# Altium project Digital_Power_Interface_Electronics.PrjPcb
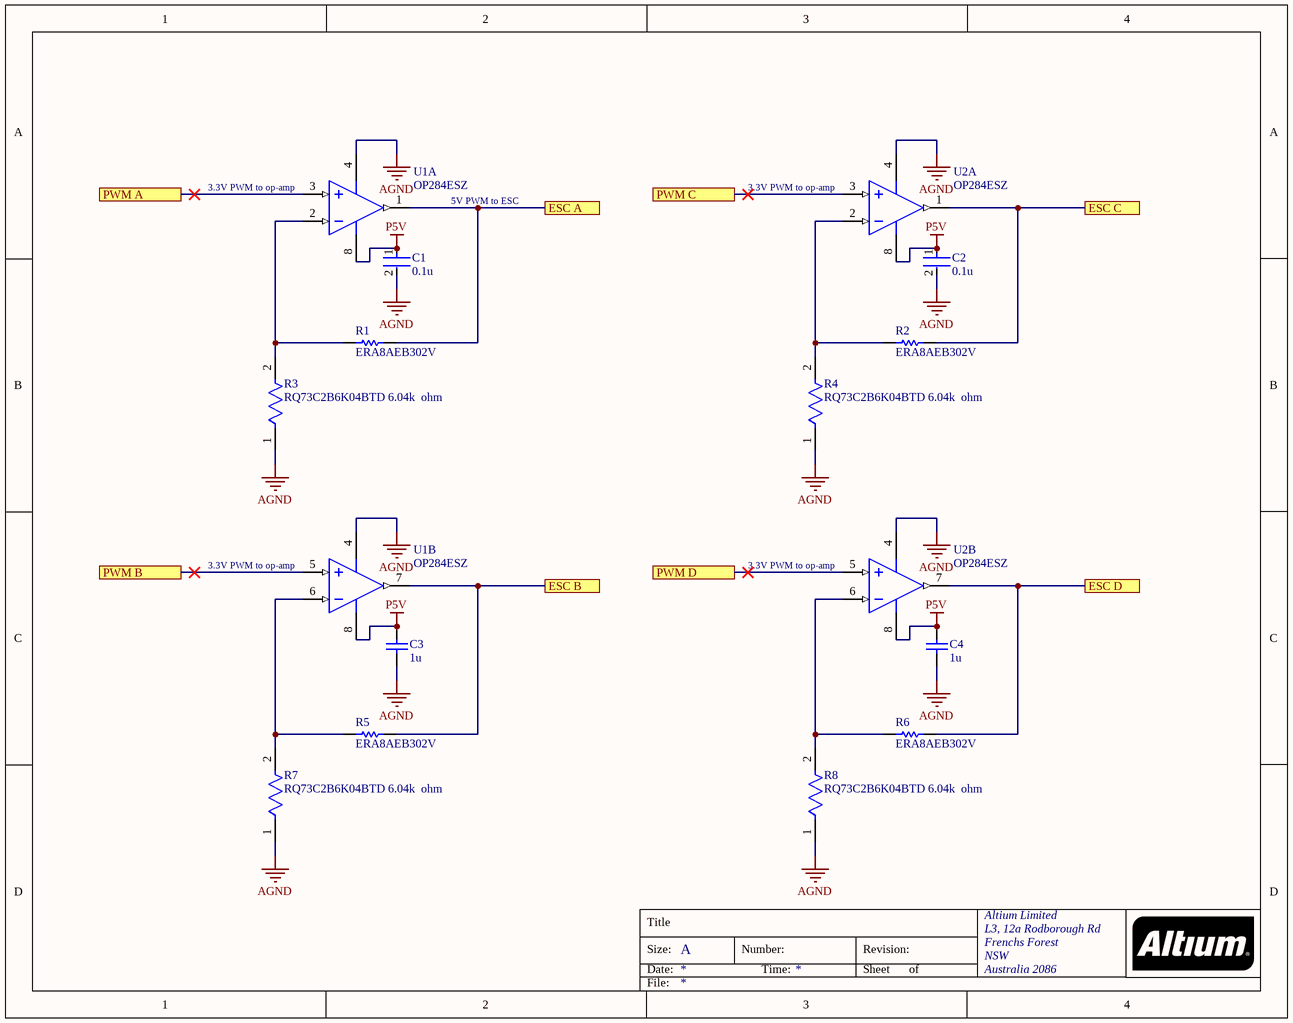
[diagram p0: PWM_Signal_Amplifiers.SchDoc]
3 sheets, 28 parts. Net scope: flat (ports and power ports of the same name join across sheets).
Board file: digital_power_board.PcbDoc
Sheets:
  PWM_Signal_Amplifiers.SchDoc
  MPU6050_Gyro_Accel_Temp.SchDoc
  Voltage_Regulator_5V.SchDoc

## Sheet PWM_Signal_Amplifiers.SchDoc
size A; Organization: Altium Limited; Address1: L3, 12a Rodborough Rd; Address2: Frenchs Forest; Address3: NSW; Address4: Australia 2086

### Parts
C1  0.1u  [FP-C0402-BB-MFG]
C2  0.1u  [FP-C0402-BB-MFG]
C3  1u  [CAPC3216X110X50LL20T25]
C4  1u  [CAPC3216X110X50LL20T25]
R1  ERA8AEB302V  [RESC3216X70X50ML20T25]
R2  ERA8AEB302V  [RESC3216X70X50ML20T25]
R3  RQ73C2B6K04BTD 6.04k  ohm  [FP-RQ732B-IPC_C]
R4  RQ73C2B6K04BTD 6.04k  ohm  [FP-RQ732B-IPC_C]
R5  ERA8AEB302V  [RESC3216X70X50ML20T25]
R6  ERA8AEB302V  [RESC3216X70X50ML20T25]
R7  RQ73C2B6K04BTD 6.04k  ohm  [FP-RQ732B-IPC_C]
R8  RQ73C2B6K04BTD 6.04k  ohm  [FP-RQ732B-IPC_C]
U1  OP284ESZ  [ADI-R-8_L]  (parts A,B of 2)
U2  OP284ESZ  [ADI-R-8_L]  (parts A,B of 2)

### Ports
ESC A, ESC B, ESC C, ESC D, PWM A, PWM B, PWM C, PWM D

### Nets
AGND: C1.2 C2.2 C3.1 C4.1 R3.1 R4.1 R7.1 R8.1 U1.4(-V) U2.4(-V)
P5V: C1.1 C2.1 C3.2 C4.2 U1.8(+V) U2.8(+V)
NetR1_1: R1.1 R3.2 U1.2(-IN_A)
NetR1_2: R1.2 U1.1(OUT_A) ; port ESC A
NetR2_1: R2.1 R4.2 U2.2(-IN_A)
NetR2_2: R2.2 U2.1(OUT_A) ; port ESC C
NetR5_1: R5.1 R7.2 U1.6(-IN_B)
NetR5_2: R5.2 U1.7(OUT_B) ; port ESC B
NetR6_1: R6.1 R8.2 U2.6(-IN_B)
NetR6_2: R6.2 U2.7(OUT_B) ; port ESC D
NetU1_3: U1.3(+IN_A) ; port PWM A
NetU1_5: U1.5(+IN_B) ; port PWM B
NetU2_3: U2.3(+IN_A) ; port PWM C
NetU2_5: U2.5(+IN_B) ; port PWM D

### Notes on the sheet
- (near U1) 3.3V PWM to op-amp
- 5V PWM to ESC
- (near U2) 3.3V PWM to op-amp
- Title
- Size:
- Date:
- A
- Number:
- Time:
- Revision:
- Sheet
- of
- File:

### Library data of the parts
C1 C2 = CMP-2008-02046-2: CAP CER 0.1UF 10V X5R 0402; Manufacturer: Kemet; Manufacturer Part Number: C0402C104K8PACTU; Material: Ceramic; Capacitance: 0.10 μF; Temperature Coefficient: 15%; Tolerance: 0.1; Value: 0.10 μF; Package: C0402-BB; Temperature: -55°C to +125°C; ComponentLink2Description: Datasheet; Temperature Characteristic: X5R; Device Class L1: Passive Components; Height: 0.55mm; Lead Free: Yes; ComponentLink2URL: https://content.kemet.com/datasheets/KEM_C1002_X7R_SMD.pdf; Device Class L2: Capacitors; Temperature Range Low: -55°C; Temperature Range High: +125°C; RoHS: TRUE; Octopart: https://octopart.com/c0402c104k8pactu-kemet-140039; Automotive: No; Mouser Description: Capacitor 100 nF 10 VDC 0402; Category: Cap; Voltage Rating: 10 V; Digikey Description: CAP CER 0.1UF 10V X5R 0402; Ipc Land Pattern Name: CAPC10050X50; Device Class L3: Ceramic Capacitors
C3 C4 = CMP-2000-06011-1: Chip Capacitor, 1 uF, +/- 10%, 50 V, -55 to 125 degC, 1206 (3216 Metric), RoHS, Tape and Reel; Manufacturer: Kemet; Case Height: 1mm; Dielectric: X7R; Voltage Rating: 50V; Capacitance: 1uF; Temperature Coefficient / Code: +/-15%; Case Length: 3.2mm; Case Width: 1.6mm; Type: SMDMLCCX7R6.3-250VDCCommericalGrade; Class: Class1; Capacitance - nF: 1000nF; Datasheet URL: http://www.kemet.com/docfinder?Partnumber=C1206C105K5RACTU; Product Category: MultilayerCeramicCapacitorsMLCC-SMD/SMT; Termination Style: SMD/SMT; Dimensions: 1.6mmWx3.2mmLx1mmH; Voltage Rating DC: 50V; Datasheet Version: 02/2016; Packaging: Reel; Brand: Kemet; RoHS: Details; Minimum Operating Temperature: -55C; Operating Temperature Range: -55Cto+125C; Package Reference: 1206; Manufacturer URL: http://www.kemet.com/; Product: GeneralTypeMLCCs; Tolerance: 10%; Package Description: 2-Pin Surface Mount Device, Body 3.2 x 1.6 mm; Mounting Technology: SurfaceMount; Case Code - mm: 3216; Maximum Operating Temperature: +125C; Series: C1206C; Factory Pack Quantity: 2500; Package / Case: 1206(3216metric); Case Code - in: 1206
R1 R2 R5 R6 = CMP-2003-04451-1: Manufacturer: Panasonic; Part Number: ERA8AEB302V
R3 R4 R7 R8 = CMP-03211-007803-1: RQ732B 1206 6.04KΩ 0.4W 10ppm/°C 0.1% 200V; Manufacturer: TE; Automotive Grade: Grade 0; Device Class L1: Passive Components; Device Class L3: Chip SMD Resistors; ComponentLink2URL: https://www.te.com/commerce/DocumentDelivery/DDEController?Action=showdoc&DocId=Data+Sheet%7F1773270-2%7FA%7Fpdf%7FEnglish%7FENG_DS_1773270-2_A.pdf%7F9-2176388-439; Voltage Rating: 200V; Category: Res; Device Class L2: Resistors; Height: 0.75mm; Temperature: -55°C to +155°C; Temperature Range High: +155°C; Temperature Range Low: -55°C; Temperature Coefficient: 10ppm/°C; Tolerance: 0.1%; RoHS: TRUE; Ipc Land Pattern Name: RESC310160X60; Value: 6.04KΩ; Power Rating: 0.4W; ComponentLink2Description: Datasheet; Automotive: Yes; Lead Free: Yes; Resistance: 6.04KΩ; Manufacturer Part Number: RQ73C2B6K04BTD; Composition: Thin Film; Octopart: https://octopart.com/rq73c2b6k04btd-te+connectivity-93912055; Series: RQ73; Package: RQ732B
U1 U2 = CMP-0384-00701-1: Double Channel Single-Supply Operation Operational Amplifier, 4.25 MHz BW, 4 V/us SR, Industrial, 8-pin SOIC (R-8), Tube; Generic Part Number: OP284; Manufacturer: Analog Devices; Slew Rate: 4V/us; Amplifiers Per Package: 2; Input Offset Voltage: 175uV; V Span Max: 36V; Iq/Amp: 2mA; V Span Min: 3V; Input Bias Current: 80nA; ComponentLink1URL: http://www.analog.com/en/index.html; PackageReference: R-8; Code_JEDEC: MS-012-AA; Small Signal Bandwidth: 4.25MHz; DatasheetVersion: Rev. J; PackageDescription: 8-Pin Standard Small Outline Package, Body 3.9 x 4.9 mm, Pitch 1.27 mm; ComponentLink3Description: Package Specification; PackageVersion: 060506-A; ComponentLink2Description: Datasheet; ComponentLink3URL: http://www.analog.com/static/imported-files/packages/PKG_PDF/SOIC_Narrow%20(R)/R_8.pdf; Mounting Technology: Surface Mount; ComponentLink2URL: http://www.analog.com/static/imported-files/data_sheets/OP184_284_484.pdf; PartNumber: OP284ESZ; ComponentLink1Description: Manufacturer URL

## Sheet MPU6050_Gyro_Accel_Temp.SchDoc
size A; Organization: Altium Limited; Address1: L3, 12a Rodborough Rd; Address2: Frenchs Forest; Address3: NSW; Address4: Australia 2086
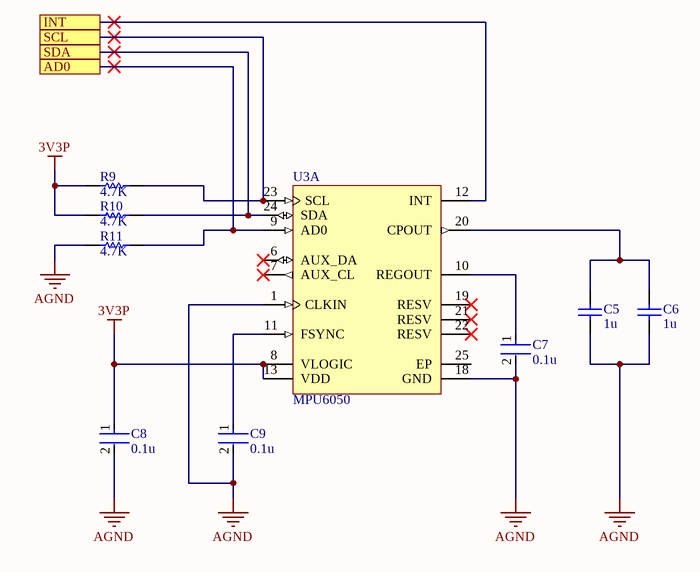
[diagram p1: MPU6050_Gyro_Accel_Temp.SchDoc]

### Parts
C5  1u  [CAPC3216X110X50LL20T25]
C6  1u  [CAPC3216X110X50LL20T25]
C7  0.1u  [FP-C0402-BB-MFG]
C8  0.1u  [FP-C0402-BB-MFG]
C9  0.1u  [FP-C0402-BB-MFG]
R9  4.7K  [RESC3216X70X50LL05T20]
R10  4.7K  [RESC3216X70X50LL05T20]
R11  4.7K  [RESC3216X70X50LL05T20]
U3  MPU6050  [INSE-QFN-24_V]  (part A of 2)

### Ports
AD0, INT, SCL, SDA

### Nets
3V3P: C8.1 R9.1 R10.1 U3.8(VLOGIC) U3.13(VDD)
AGND: C5.1 C6.1 C7.2 C8.2 C9.2 R11.1 U3.1(CLKIN) U3.18(GND)
NetC5_2: C5.2 C6.2 U3.20(CPOUT)
NetC7_1: C7.1 U3.10(REGOUT)
NetC9_1: C9.1 U3.11(FSYNC)
NetR9_2: R9.2 U3.23(SCL) ; port SCL
NetR10_2: R10.2 U3.24(SDA) ; port SDA
NetR11_2: R11.2 U3.9(AD0) ; port AD0
NetU3_12: U3.12(INT) ; port INT

Not connected (* = marked no-connect by the designer): U3 6(AUX_DA)* 7(AUX_CL)* 19(RESV)* 21(RESV)* 22(RESV)* 25(EP)

### Notes on the sheet
- Title
- Size:
- Date:
- A
- Number:
- Time:
- Revision:
- Sheet
- of
- File:

### Library data of the parts
C5 C6 = CMP-2000-06011-1: as C3 on sheet PWM_Signal_Amplifiers; Datasheet URL: http://www.kemet.com/docfinder?Partnumber=C1206C105K5RACTU; Product Category: MultilayerCeramicCapacitorsMLCC-SMD/SMT; Termination Style: SMD/SMT; Dimensions: 1.6mmWx3.2mmLx1mmH; Voltage Rating DC: 50V; Datasheet Version: 02/2016; Packaging: Reel; Brand: Kemet; RoHS: Details; Minimum Operating Temperature: -55C; Operating Temperature Range: -55Cto+125C; Package Reference: 1206; Manufacturer URL: http://www.kemet.com/; Product: GeneralTypeMLCCs; Tolerance: 10%; Package Description: 2-Pin Surface Mount Device, Body 3.2 x 1.6 mm; Mounting Technology: SurfaceMount; Case Code - mm: 3216; Maximum Operating Temperature: +125C; Series: C1206C; Factory Pack Quantity: 2500; Package / Case: 1206(3216metric); Case Code - in: 1206
C7-C9 = CMP-2008-02046-2: as C1 on sheet PWM_Signal_Amplifiers; Package: C0402-BB; Temperature: -55°C to +125°C; ComponentLink2Description: Datasheet; Temperature Characteristic: X5R; Device Class L1: Passive Components; Height: 0.55mm; Lead Free: Yes; ComponentLink2URL: https://content.kemet.com/datasheets/KEM_C1002_X7R_SMD.pdf; Device Class L2: Capacitors; Temperature Range Low: -55°C; Temperature Range High: +125°C; RoHS: TRUE; Octopart: https://octopart.com/c0402c104k8pactu-kemet-140039; Automotive: No; Mouser Description: Capacitor 100 nF 10 VDC 0402; Category: Cap; Voltage Rating: 10 V; Digikey Description: CAP CER 0.1UF 10V X5R 0402; Ipc Land Pattern Name: CAPC10050X50; Device Class L3: Ceramic Capacitors
R9-R11 = CMP-2003-00848-1: Part Number: ERJ8ENF4701V; Manufacturer: Panasonic
U3 = CMP-1753-00002-1: 3-Axis Gyroscope, 3-Axis Accelerometer / , 2.375 to 3.46 V, -40 to 105 degC, 24-Pin QFN, RoHS, Tape and Reel; Resistance: 5.6 kohm; Tolerance: 1%; Voltage Rating: 75 V; Power Rating: 100 mW; ComponentLink1Description: Manufacturer URL; Mount: Surface Mount; Max Operating Temperature: 155degC; Package Quantity: 5000; ComponentLink2Description: Datasheet; Pins: 2; Packaging: Tape and Reel; Case Code (Imperial): 0603; PackageReference: QFN-24; ComponentLink2URL: https://datasheet.ciiva.com/1513/1788002-1513632.pdf; Radiation Hardening: No; ComponentLink1URL: http://www.invensense.com/; PackageDescription: 24-Pin Quad Flat No-lead Package, Body 4 x 4 mm, Pitch 0.5 mm; Height: 0.45 mm; Case/Package: 0603; Case Code (Metric): 1608; REACH SVHC: Yes; Min Operating Temperature: -55degC; DatasheetVersion: Rev. 3.4, 08/2013; Width: 0.8 mm; RoHSCompliant: True; Length: 1.6 mm

## Sheet Voltage_Regulator_5V.SchDoc
size A
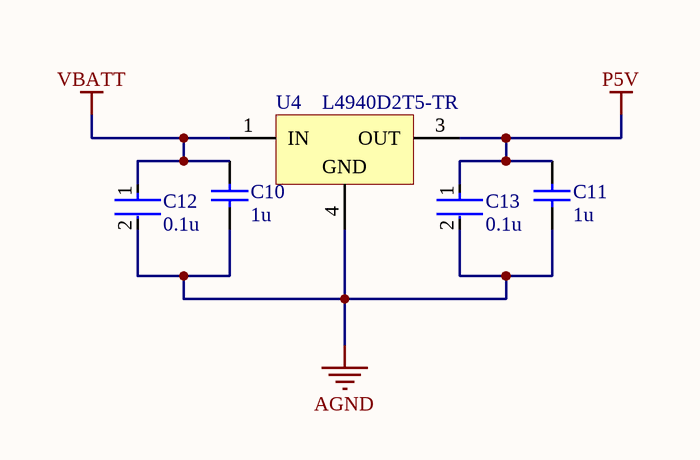
[diagram p2: Voltage_Regulator_5V.SchDoc]

### Parts
C10  1u  [CAPC3216X110X50LL20T25]
C11  1u  [CAPC3216X110X50LL20T25]
C12  0.1u  [FP-C0402-BB-MFG]
C13  0.1u  [FP-C0402-BB-MFG]
U4  L4940D2T5-TR  [TO-263_M]

### Nets
AGND: C10.1 C11.1 C12.2 C13.2 U4.4(GND)
P5V: C11.2 C13.1 U4.3(OUT)
VBATT: C10.2 C12.1 U4.1(IN)

### Library data of the parts
C10 C11 = CMP-2000-06011-1: as C3 on sheet PWM_Signal_Amplifiers; Datasheet URL: http://www.kemet.com/docfinder?Partnumber=C1206C105K5RACTU; Product Category: MultilayerCeramicCapacitorsMLCC-SMD/SMT; Termination Style: SMD/SMT; Dimensions: 1.6mmWx3.2mmLx1mmH; Voltage Rating DC: 50V; Datasheet Version: 02/2016; Packaging: Reel; Brand: Kemet; RoHS: Details; Minimum Operating Temperature: -55C; Operating Temperature Range: -55Cto+125C; Package Reference: 1206; Manufacturer URL: http://www.kemet.com/; Product: GeneralTypeMLCCs; Tolerance: 10%; Package Description: 2-Pin Surface Mount Device, Body 3.2 x 1.6 mm; Mounting Technology: SurfaceMount; Case Code - mm: 3216; Maximum Operating Temperature: +125C; Series: C1206C; Factory Pack Quantity: 2500; Package / Case: 1206(3216metric); Case Code - in: 1206
C12 C13 = CMP-2008-02046-2: as C1 on sheet PWM_Signal_Amplifiers; Package: C0402-BB; Temperature: -55°C to +125°C; ComponentLink2Description: Datasheet; Temperature Characteristic: X5R; Device Class L1: Passive Components; Height: 0.55mm; Lead Free: Yes; ComponentLink2URL: https://content.kemet.com/datasheets/KEM_C1002_X7R_SMD.pdf; Device Class L2: Capacitors; Temperature Range Low: -55°C; Temperature Range High: +125°C; RoHS: TRUE; Octopart: https://octopart.com/c0402c104k8pactu-kemet-140039; Automotive: No; Mouser Description: Capacitor 100 nF 10 VDC 0402; Category: Cap; Voltage Rating: 10 V; Digikey Description: CAP CER 0.1UF 10V X5R 0402; Ipc Land Pattern Name: CAPC10050X50; Device Class L3: Ceramic Capacitors
U4 = CMP-0244-00196-1: 1.5A Very Low Drop Regulator, 3-Pin D2PAK, Tape and Reel; ComponentLink1URL: http://www.st.com; DatasheetVersion: 16/12/2009; PackageReference: TO-263; ComponentLink2Description: Datasheet; ComponentLink2URL: http://www.st.com/internet/com/TECHNICAL_RESOURCES/TECHNICAL_LITERATURE/DATASHEET/CD00000442.pdf; PackageVersion: 2011; PackageDescription: 3-Pin Transistor Outline Package 2.54 mm Pitch, 15.4 mm Lead Span (D2PAK); ComponentLink1Description: Manufacturer URL

## Nets that join several sheets
AGND: PWM_Signal_Amplifiers (10 pins), MPU6050_Gyro_Accel_Temp (8 pins), Voltage_Regulator_5V (5 pins)
P5V: PWM_Signal_Amplifiers (6 pins), Voltage_Regulator_5V (C11.2 C13.1 U4.3)